# Altium schematic sheet Sheet2.SchDoc: D AMP
size A4; Revision: 1.0; SheetNumber: 2; SheetTotal: 5
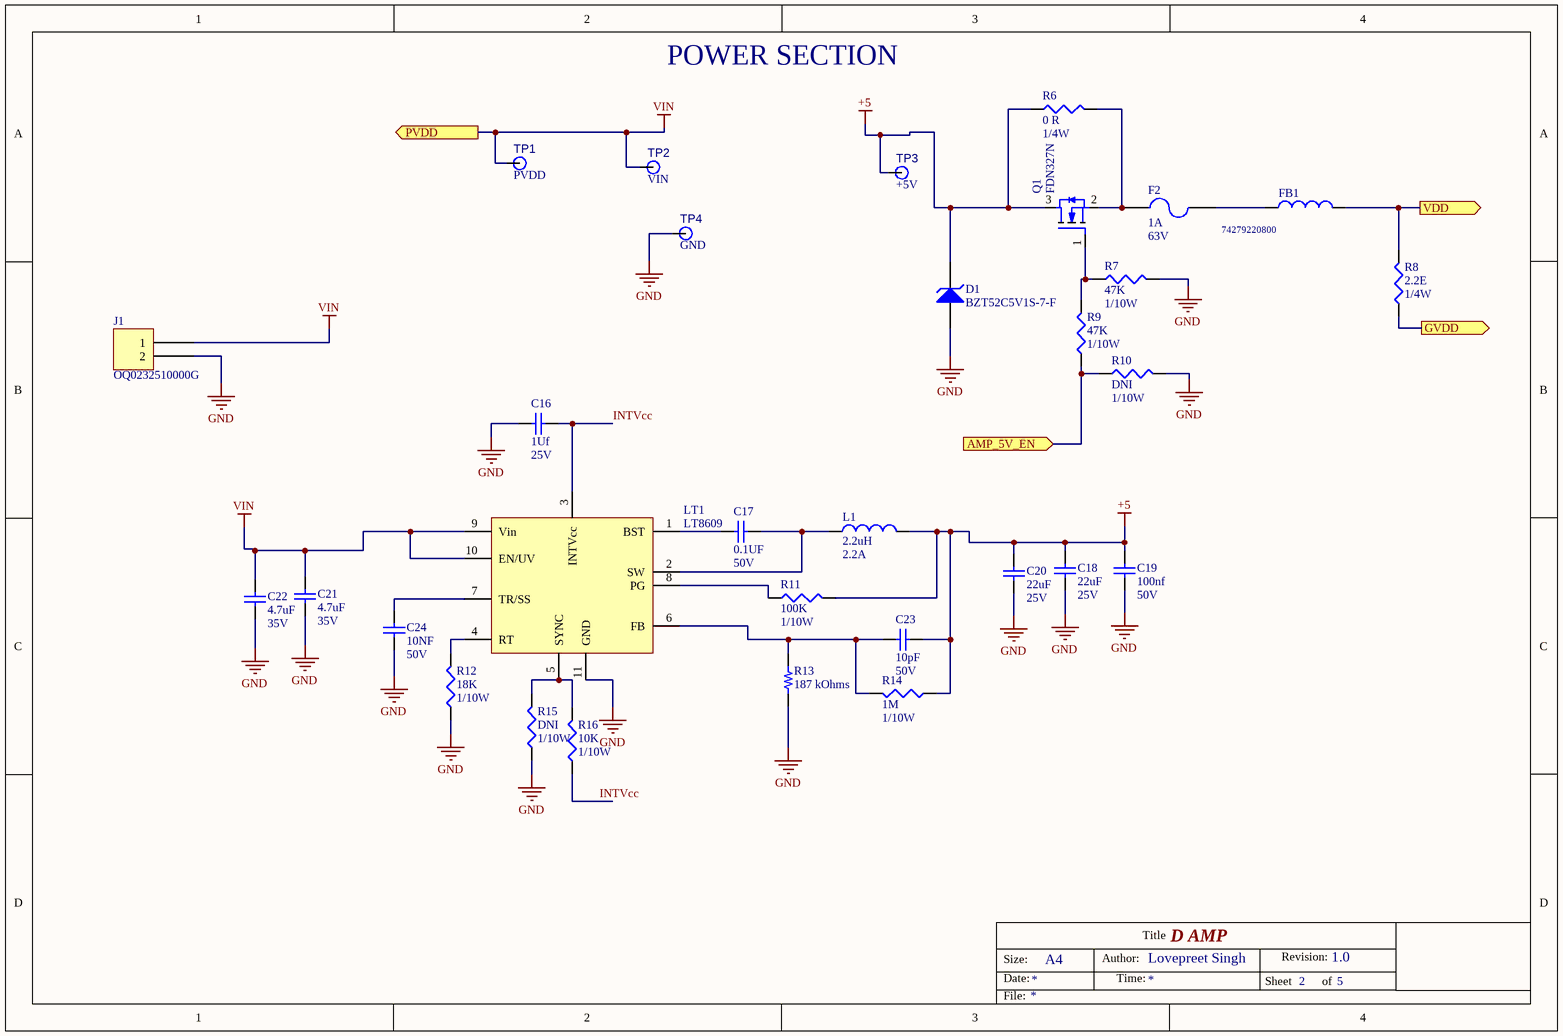
[diagram p0: Sheet2.SchDoc]

## Parts
C16  1Uf  VRating: 25V  [C0603]
C17  0.1UF  VRating: 50V  [2P0603R]
C18  22uF  VRating: 25V  [C1206]
C19  100nf  VRating: 50V  [C0603]
C20  22uF  VRating: 25V  [C1206]
C21  4.7uF  VRating: 35V  [C0603]
C22  4.7uF  VRating: 35V  [C0603]
C23  10pF  VRating: 50V  [C0603]
C24  10NF  VRating: 50V  [C0603]
D1  BZT52C5V1S-7-F  [SOD-323]
F2  1A  VRating: 63V  [FUSE1206]
FB1  74279220800  [L0805]
J1  OQ0232510000G  [FCI 06-381-2PIN]
L1  2.2uH  IRating: 2.2A  [CDMC252012]
LT1  LT8609  [MSOP-10]
Q1  FDN327N  [SOT23_123]
R6  0 R  PRating: 1/4W  [R1206]
R7  47K  PRating: 1/10W  [R0603]
R8  2.2E  PRating: 1/4W  [R1206]
R9  47K  PRating: 1/10W  [R0603]
R10  DNI  PRating: 1/10W  [R0603]
R11  100K  PRating: 1/10W  [R0603]
R12  18K  PRating: 1/10W  [R0603]
R13  187 kOhms  [RES 0603_1608]
R14  1M  PRating: 1/10W  [R0603]
R15  DNI  PRating: 1/10W  [R0603]
R16  10K  PRating: 1/10W  [R0603]
TP1  PVDD  [TP_THROUGH]  (no BOM)
TP2  VIN  [TP_THROUGH]  (no BOM)
TP3  +5V  [TP_THROUGH]  (no BOM)
TP4  GND  [TP_THROUGH]  (no BOM)

## Ports
AMP_5V_EN (in), GVDD (out), PVDD (out), VDD (out)

## Nets
+5: C18.2 C19.2 C20.2 C23.2 D1.K L1.2 Q1.3(D) R6.1 R11.2 R14.1 TP3.1
GND: C16.1 C18.1 C19.1 C20.1 C21.1 C22.1 C24.1 D1.A J1.2 LT1.11(GND) R7.2 R10.2 R12.1 R13.1 R15.1 TP4.1
VIN: C21.2 C22.2 J1.1 LT1.9(Vin) LT1.10(EN/UV) TP1.1 TP2.1 ; port PVDD
AMP_5V_EN: R9.1 R10.1 ; port AMP_5V_EN
GVDD: R8.1 ; port GVDD
INTVcc: C16.2 LT1.3(INTVcc) R16.1
VDD: FB1.2 R8.2 ; port VDD
NetC17_1: C17.1 LT1.1(BST)
NetC17_2: C17.2 L1.1 LT1.2(SW)
NetC23_1: C23.1 LT1.6(FB) R13.2 R14.2
NetC24_2: C24.2 LT1.7(TR/SS)
NetF2_1: F2.1 Q1.2(S) R6.2
NetF2_2: F2.2 FB1.1
NetLT1_4: LT1.4(RT) R12.2
NetLT1_5: LT1.5(SYNC) R15.2 R16.2
NetLT1_8: LT1.8(PG) R11.1
NetQ1_1: Q1.1(G) R7.1 R9.2

## Notes on the sheet
- POWER SECTION
- Size:
- Date:
- A4
- Author:
- Time:
- Title
- Lovepreet Singh
- Sheet
- Revision:
- of
- File:

## Library data of the parts
C16 = CAP-00113: CAP MLCC SMD 25V 1uF 10% X7R 0603; Manufacturer 1: KEMET; Manufacturer 1 PN: C0603C105K3RACTU; SAP PN: 1100016000; PB-Free: YES; Grade: Commercial; DB Ref: CAP-00113; Life Cycle: Released; Value: 1Uf; Tolerence: 10%; TRating: X7R; ROHS Comp: YES; Operating Temp: -55°C to +125°C; SMD/TH: SMD
C17 = CAP-00148: CAP CER 0.1UF 10% 50V X7R 0603; Manufacturer 1: AVX; Manufacturer 1 PN: 06035C104KAT2A; Manufacturer 2 PN: CC0603KRX7R9BB104; Manufacturer 3 PN: C0603C104K5RACTU; SAP PN: 1100013821; SMD/TH: SMD; PB-Free: YES; Grade: UNKNOWN; DB Ref: CAP-00148; Life Cycle: Released; Value: 0.1UF; Tolerence: 10%; TRating: X7R; ROHS Comp: YES; Operating Temp: -55°C to +125°C; Manufacturer 2: YAGEO; Manufacturer 3: KEMET
C18 C20 = CAP-00019: CAP CER 22uF 20% 25V X5R 1206; Manufacturer 1: Yageo; Manufacturer 1 PN: CC1206MKX5R8BB226; Manufacturer 2 PN: GRM31CR61E226ME15L; Manufacturer 3 PN: TMK316BBJ226ML-T; SAP PN: 1100013275; SMD/TH: SMD; PB-Free: UNKNOWN; DB Ref: CAP-00019; Life Cycle: Released; Value: 22uF; Tolerence: 20%; TRating: X5R; Manufacturer 2: Murata; Manufacturer 3: Taiyo Yuden; ROHS Comp: YES; Operating Temp: -55°C to +85°C; Grade: UNKNOWN
C19 = CAP-00018: CAP CER 100NF 10% 50V X7R 0603; Manufacturer 1: Yageo; Manufacturer 1 PN: CC0603KRX7R9BB104; Manufacturer 2 PN: GRM188R71H104KA93D; Manufacturer 3 PN: 06035C104KAT2A; SAP PN: 1100013274; SMD/TH: SMD; PB-Free: UNKNOWN; DB Ref: CAP-00018; Life Cycle: Released; Value: 100nf; Tolerence: 10%; TRating: X7R; Manufacturer 2: Murata; ROHS Comp: YES; Operating Temp: -55°C to +125°C; Grade: UNKNOWN; Manufacturer 3: AVX
C21 C22 = CAP-00063: CAP CER 4.7UF 20% 35V X5R 0603; Manufacturer 1: MURATA; Manufacturer 1 PN: ZRB18AR6YA475ME05L; Manufacturer 2 PN: C1608X5R1V475K080AC; Manufacturer 3 PN: GRM188R6YA475KE15J; SAP PN: 1100014582; SMD/TH: SMD; PB-Free: UNKNOWN; Grade: Commercial; Cost Price: $0.36; DB Ref: CAP-00063; Life Cycle: Released; Value: 4.7uF; Tolerence: 20%; TRating: X5R; ROHS Comp: YES; Operating Temp: -55°C to +85°C; Manufacturer 2: TDK; Manufacturer 3: MURATA
C23 = CAP-00095: CAP 10PF 5% 50V 0603; Manufacturer 1: YAGEO; Manufacturer 1 PN: CC0603JRNPO9BN100; Manufacturer 2 PN: 06035A100JAT2A; SAP PN: 1100015723; TRating: C0G(NPO); SMD/TH: SMD; PB-Free: UNKNOWN; DB Ref: CAP-00095; Life Cycle: Released; Value: 10pF; Tolerence: 5%; Manufacturer 2: AVX; ROHS Comp: YES; Operating Temp: -55°C to +125°C; Grade: UNKNOWN
C24 = CAP-00022: CAP CER 10NF 10% 50V X7R 0603; Manufacturer 1: Yageo; Manufacturer 1 PN: CC0603KRX7R9BB103; Manufacturer 2 PN: C0603C103K5RACTU; Manufacturer 3 PN: 06035C103KAQ2A; SAP PN: 1100013278; SMD/TH: SMD; PB-Free: UNKNOWN; Grade: Commercial; DB Ref: CAP-00022; Life Cycle: Released; Value: 10NF; Tolerence: 10%; TRating: X7R; ROHS Comp: YES; Operating Temp: -55°C to +125°C; Manufacturer 2: Kemet; Manufacturer 3: AVX
D1 = DIO-00030: DIODE ZENER 5.1V 200MW SOD323; Manufacturer 1: Diodes Inc; IRating: 2uA; SMD/TH: SMD; PB-Free: YES; Grade: UNKNOWN; DB Ref: DIO-00030; Life Cycle: Preliminary; VRating: 5.1V; Manufacturer 1 PN: BZT52C5V1S-7-F; ROHS Comp: YES; Operating Temp: -65°C to +150°C; Storage Temp: -65°C to +150°C
F2 = FUZ-00001: Fuse 1A 63V Slow Blow SMD 1206; Manufacturer 1: BEL FUSE; Manufacturer 1 PN: C1S 1; Manufacturer 2 PN: 12H1100C; SAP PN: 1100013300; Grade: UNKNOWN; PB-Free: YES; DB Ref: FUZ-00001; Life Cycle: Released; IRating: 1A; Manufacturer 2: LS; ROHS Comp: YES; Operating Temp: -55℃ to +125℃; SMD/TH: SMD
FB1 = FER-00017: IND FERRITE CHIP 80 OHM 4A 0805; Manufacturer 1: Wurth; SAP PN: 1100016692; Impedance: 80E; SMD/TH: SMD; Grade: AEC-Q200; PB-Free: UNKNOWN; DB Ref: FER-00017; Lifecycle: Released; IRating: 4A; Manufacturer 1 PN: 74279220800; ROHS Comp: YES; Operating Temp: -55°C to +125°C
J1 = OQ0232510000G: TERM BLOCK HDR 2POS 90DEG 3.81MM; Manufacturer: Amphenol Anytek; Current - UL: 10A; Header Orientation: 90°, Right Angle; Number of Levels: 1; Number of Positions: 2; Pitch: 0.150" (3.81mm); Voltage - UL: 300V; Part Number: OQ0232510000G; Color: Green; ComponentLink1Description: Datasheet; ComponentLink1URL: http://portal.fciconnect.com/Comergent//fci/drawing/oqxx32x100j0g.pdf; ComponentLink2Description: DigiKey Link; ComponentLink2URL: //digikey.com/product-detail/en/amphenol-anytek/OQ0232510000G/609-3819-ND/2261255; Contact Mating Finish: Tin; LastUpdated: 16-12-2019 07:14:30 PM; Lifecycle Status: 0; Minimum Order: 1; Mounting Type: Through Hole; Operating Temperature: -40°C ~ 115°C; Packaging: Bulk; Part Status: Active; Positions Per Level: 2; Price: 0.49; Series: 06-381; Supplier 1: DigiKey; Supplier Part Number 1: 609-3819-ND; Termination Style: Solder; Type: Header, Male Pins, Shrouded (4 Side)
L1 = IND-00008: FIXED IND 2.2UH 2A 168 MOHM SMD; Manufacturer 1: Murata; Manufacturer 1 PN: DFE201610P-2R2M=P2; SAP PN: 1100015033; Grade: UNKNOWN; DB Ref: IND-00008; Life Cycle: Released; LRating: 2.2uH; ROHS Comp: YES; Operating Temp: -40℃ to +125℃; SMD/TH: SMD; PB-Free: UNKNOWN
LT1 = IC-00055: IC SWTCH REG O/P ADJ 3A I/P 4.5V-42V SMD 10MSOP; Manufacturer 1: Linear Technology; Manufacturer 1 PN: LT8609AEMSE#WPBF; Manufacturer 2 PN: LT8609AIMSE#PBF; SAP PN: 1100016016; PB-Free: UNKNOWN; Grade: AEC-Q100; DB Ref: IC-00055; Life Cycle: Released; Manufacturer 2: LT; ROHS Comp: YES; Operating Temp: -40°C to +125°C; SMD/TH: SMD; Storage Temp: -65°C to +150°C
Q1 = TRS-00013: MOSFET N-CH 20V 2A SSOT-3; Manufacturer 1: Fairchild; Manufacturer 2 PN: PMV28UNEA; SAP PN: 1100016010; Type: NMOS; SMD/TH: SMD; Grade: UNKNOWN; DB Ref: TRS-00013; Life Cycle: Released; VRating: 20V; Irating: 2A; Manufacturer 1 PN: FDN327N; Manufacturer 2: Nexperia; ROHS Comp: YES; Operating Temp: -55°C to +150°C; Storage Temp: -55°C to +150°C; PB-Free: UNKNOWN
R6 = RES-00030: RES SMD 0E 5% 1/4W 1206; Manufacturer 1: VISHAY; Manufacturer 1 PN: CRCW12060000Z0EA; Manufacturer 2 PN: AA1206JR-070RL; Manufacturer 3 PN: ERJ-8GEY0R00V; SAP PN: 1100013345; Tolerance(%): 5; Grade: UNKNOWN; DB Ref: RES-00030; Life Cycle: Released; Value: 0 R; Manufacturer 2: YAGEO; Manufacturer 3: PANASONIC; ROHS Comp: YES; Operating Temp: -55°C to +155°C; SMD/TH: SMD; PB-Free: UNKNOWN
R7 R9 = RES-00032: RES SMD  47K 1% 1/10W 0603; Manufacturer 1: Yageo; Manufacturer 1 PN: RC0603FR-0747KL; Manufacturer 2 PN: RMCF0603FT47K0; SAP PN: 1100013347; Tolerance(%): 1; Grade: UNKNOWN; DB Ref: RES-00032; Life Cycle: Released; Value: 47K; Manufacturer 2: Stackpole; Manufacturer 3: ROYAL OHM; Manufacturer 3 PN: RMCF0603FT47K0; ROHS Comp: YES; Operating Temp: -55°C to +155°C; SMD/TH: SMD; PB-Free: UNKNOWN
R8 = RES-00036: RES SMD 2.2E 1% 1/4W 1206; Manufacturer 1: Yageo; Manufacturer 1 PN: RC1206FR-072R2L; Manufacturer 2 PN: AC1206FR-072R2L; SAP PN: 1100013352; Tolerance(%): 1; Grade: UNKNOWN; DB Ref: RES-00036; Life Cycle: Released; Value: 2.2E; Manufacturer 2: Yageo; ROHS Comp: YES; Operating Temp: -55°C to +155°C; SMD/TH: SMD; PB-Free: UNKNOWN
R10 R15 = RES-00071: RES SMD DNI 0603; DB Ref: RES-00071; Life Cycle: Preliminary; Value: DNI
R11 = RES-00024: RES SMD 100K 1% 1/10W 0603; Manufacturer 1: Yageo; Manufacturer 1 PN: RC0603FR-07100KL; Manufacturer 2 PN: RMCF0603FT100K; Manufacturer 3 PN: RK73H1JRTTD1003F; SAP PN: 1100013339; Tolerance(%): 1; Cost Price: $0.1; Grade: UNKNOWN; DB Ref: RES-00024; Life Cycle: Released; Value: 100K; Manufacturer 2: Stackpole; Manufacturer 3: KOA Speer; ROHS Comp: YES; Operating Temp: -55°C to +155°C; SMD/TH: SMD; PB-Free: UNKNOWN
R12 = RES-00122: RES 18K OHM 1% 1/10W 0603; Manufacturer 1: Panasonic; Manufacturer 1 PN: ERJ-3EKF1802V; Manufacturer 2 PN: CRCW060318K0FKEA; Manufacturer 3 PN: RK73H1JTTD1802F; SAP PN: 1100016014; Tolerance(%): 1; SMD/TH: SMD; Grade: AEC-Q200; PB-Free: UNKNOWN; DB Ref: RES-00122; Life Cycle: Released; Value: 18K; Manufacturer 2: Vishay; Manufacturer 3: KOA Speer; ROHS Comp: YES; Operating Temp: -55°C to +155°C
R13 = RT0603DRE07187KL: RES SMD 187K OHM 0.5% 1/10W 0603; Manufacturer: Yageo; Power (Watts): 0.1W, 1/10W; Temperature Coefficient: ±50ppm/°C; Part Number: RT0603DRE07187KL; Value: 187 kOhms; ComponentLink1Description: Datasheet; ComponentLink1URL: https://www.yageo.com/upload/media/product/productsearch/datasheet/rchip/PYu-RT_1-to-0.01_RoHS_L_11.pdf; ComponentLink2Description: DigiKey Link; ComponentLink2URL: http://digikey.com/product-detail/en/yageo/RT0603DRE07187KL/311-2449-1-ND/6128868; Composition: Thin Film; Device Package: 0603 (1608 Metric); Height - Seated (Max): 0.022" (0.55mm); LastUpdated: 02-09-2020 01:10:14 AM; Lifecycle Status: Active; Minimum Order: 1; Number of Terminations: 2; Operating Temperature: -55°C ~ 155°C; Package / Case: 0603 (1608 Metric); Packaging: TapeAndReel; PartId: 9938; Part Status: Active; Price: 0.01; Resistance: 187 kOhms; Series: RT; Size / Dimension: 0.063" L x 0.031" W (1.60mm x 0.80mm); Supplier 1: DigiKey; Supplier Part Number 1: 311-2449-1-ND; Supplier Device Package: 0603; Tolerance: ±0.5%
R14 = RES-00027: RES SMD 1M 1% 1/10W 0603; Manufacturer 1: Yageo; Manufacturer 1 PN: RC0603FR-071ML; Manufacturer 2 PN: RK73H1JTTDD1004F; Manufacturer 3 PN: ERJ-3EKF1004V; SAP PN: 1100013342; Tolerance(%): 1; Grade: UNKNOWN; DB Ref: RES-00027; Life Cycle: Released; Value: 1M; ROHS Comp: YES; Operating Temp: -55°C to +155°C; SMD/TH: SMD; PB-Free: UNKNOWN; Manufacturer 2: KOA Speer; Manufacturer 3: Panasonic
R16 = RES-00012: RES SMD 10K 1% 1/10W 0603; Manufacturer 1: Yageo; Manufacturer 1 PN: RC0603FR-0710KL; Manufacturer 2 PN: ERJ-3EKF1002V; Manufacturer 3 PN: RK73H1JRTTD1002F; SAP PN: 1100013326; Tolerance(%): 1; Grade: UNKNOWN; DB Ref: RES-00012; Life Cycle: Released; Value: 10K; Manufacturer 2: Panasonic; Manufacturer 3: KOA Speer; ROHS Comp: YES; Operating Temp: -55°C to +155°C; SMD/TH: SMD; PB-Free: UNKNOWN
TP1-TP4 = TP-005: TEST_POINT_THROUGH; DB Ref: TP-005; Life Cycle: Approved